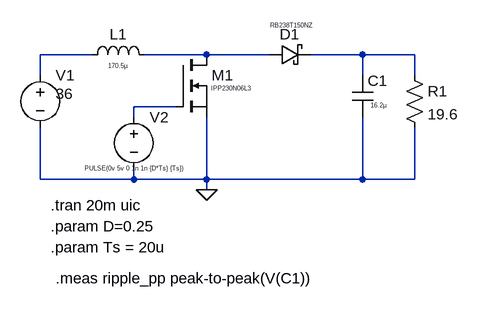
[diagram p0: schematic DC_DC_Boost converter.asc]
DC_DC_Boost converter.asc, the LTspice schematic file:
Version 4
SHEET 1 880 680
WIRE 32 112 -48 112
WIRE 208 112 112 112
WIRE 304 112 208 112
WIRE 448 112 368 112
WIRE 528 112 448 112
WIRE -48 144 -48 112
WIRE 448 144 448 112
WIRE 528 144 528 112
WIRE 160 192 96 192
WIRE 96 208 96 192
WIRE -48 304 -48 224
WIRE 96 304 96 288
WIRE 96 304 -48 304
WIRE 208 304 208 208
WIRE 208 304 96 304
WIRE 448 304 448 208
WIRE 448 304 208 304
WIRE 528 304 528 224
WIRE 528 304 448 304
WIRE 208 320 208 304
FLAG 208 320 0
SYMBOL ind 128 128 M270
WINDOW 0 32 56 VTop 2
WINDOW 3 5 56 VBottom 0
SYMATTR InstName L1
SYMATTR Value 170.5µ
SYMBOL schottky 304 128 R270
WINDOW 0 32 32 VTop 2
WINDOW 3 68 35 VBottom 0
SYMATTR InstName D1
SYMATTR Value RB238T150NZ
SYMATTR Description Diode
SYMATTR Type diode
SYMBOL cap 432 144 R0
WINDOW 3 28 46 Left 0
SYMATTR InstName C1
SYMATTR Value 16.2µ
SYMBOL res 512 128 R0
SYMATTR InstName R1
SYMATTR Value 19.6
SYMBOL nmos 160 112 R0
WINDOW 3 55 52 Left 0
SYMATTR Value IPP230N06L3
SYMATTR InstName M1
SYMBOL voltage 96 192 R0
WINDOW 3 -76 95 Left 0
WINDOW 123 0 0 Left 0
WINDOW 39 0 0 Left 0
SYMATTR Value PULSE(0v 5v 0 1n 1n {D*Ts} {Ts})
SYMATTR InstName V2
SYMBOL voltage -48 128 R0
WINDOW 3 24 44 Left 2
WINDOW 123 0 0 Left 0
WINDOW 39 0 0 Left 0
SYMATTR Value 36
SYMATTR InstName V1
TEXT -32 344 Left 2 !.tran 20m uic
TEXT -32 376 Left 2 !.param D=0.25
TEXT -32 408 Left 2 !.param Ts = 20u
TEXT -24 456 Left 2 !.meas ripple_pp peak-to-peak(V(C1))

The netlist it stands for:
* DC_DC_Boost converter.asc
L1 N002 N001 170.5µ
D1 N002 N003 RB238T150NZ
C1 N003 0 16.2µ
R1 N003 0 19.6
M1 N002 N004 0 0 IPP230N06L3
V2 N004 0 PULSE(0v 5v 0 1n 1n {D*Ts} {Ts})
V1 N001 0 36
.model D D
.lib standard.dio
.model NMOS NMOS
.model PMOS PMOS
.lib standard.mos
.tran 20m uic
.param D=0.25
.param Ts = 20u
.meas ripple_pp peak-to-peak(V(C1))
.backanno
.end